# EAGLE design main (EAGLE 9.6.2)
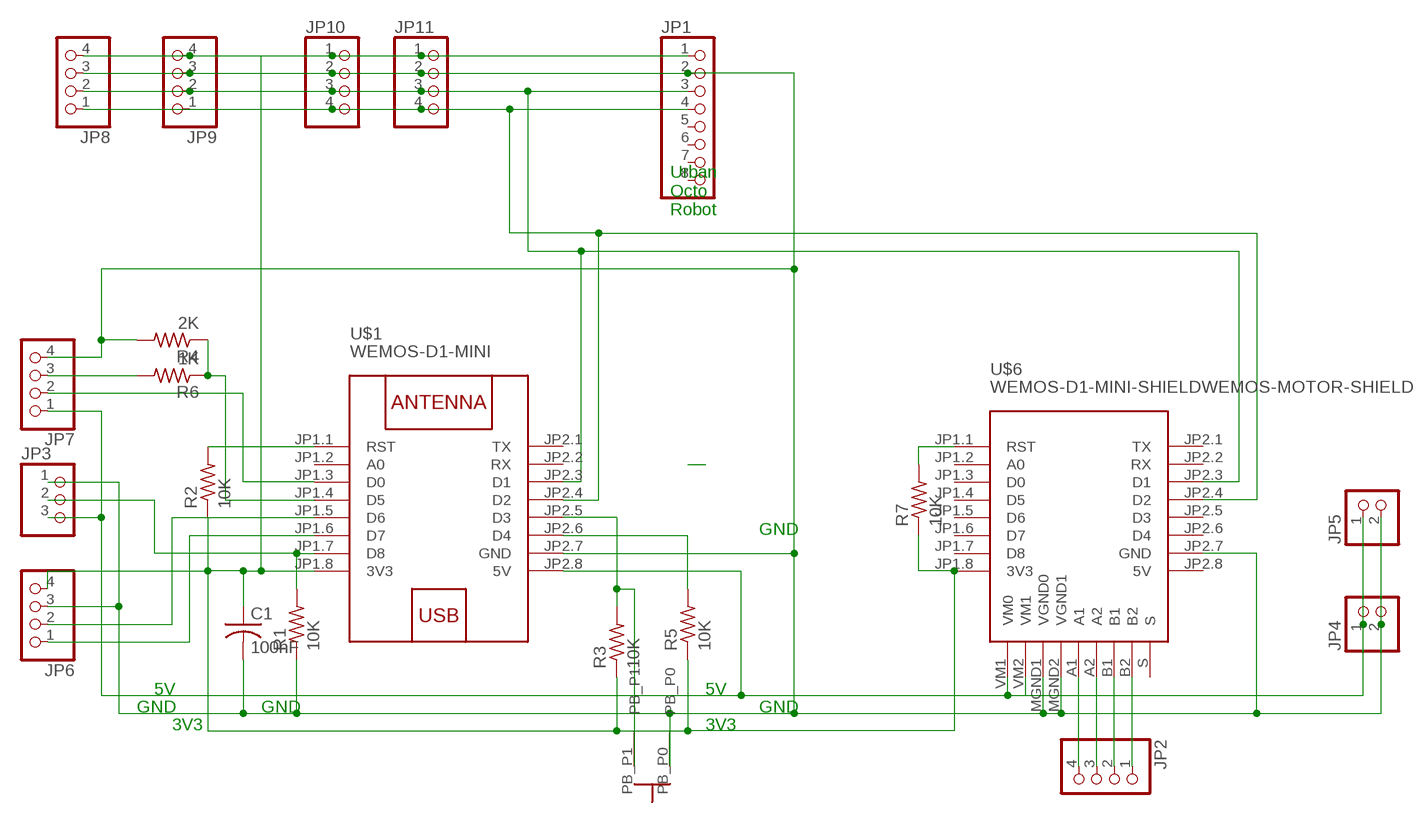
[diagram p0: schematic, sheet 1]

## Parts
C1  100nF  C-US050-024X044  [C050-024X044]
JP1  PINHD-1X8  [1X08]
JP2  PINHD-1X4/90  [1X04/90]
JP3  PINHD-1X3  [1X03]
JP4  PINHD-1X2  [1X02]
JP5  PINHD-1X2  [1X02]
JP6  PINHD-1X4  [1X04]
JP7  PINHD-1X4  [1X04]
JP8  PINHD-1X4  [1X04]
JP9  PINHD-1X4  [1X04]
JP10  PINHD-1X4  [1X04]
JP11  PINHD-1X4  [1X04]
R1  10K  R-US_0204/7  [0204/7]
R2  10K  R-US_0204/7  [0204/7]
R3  10K  R-US_0204/7  [0204/7]
R4  2K  R-US_0309/V  [0309V]
R5  10K  R-US_0204/7  [0204/7]
R6  1K  R-US_0309/V  [0309V]
R7  10K  R-US_0204/7  [0204/7]
U$1  WEMOS-D1-MINI  [WEMOS-D1-MINI]
U$6  WEMOS-D1-MINI-SHIELDWEMOS-MOTOR-SHIELD  [WEMOS-D1-MINI-SHIELD]
U$7  BUTTON6X6X10MMSIDE  [BUTTON6X6X10MMSIDE]

## Nets
N$1: JP2.4 U$6.A1
N$5: R7.2 U$6.JP1.1(RST)
N$6: JP3.3 JP4.1 JP5.1 JP7.1 U$1.JP2.8(5V) U$6.VM1(VM0) U$6.VM2(VM1)
N$9: JP7.3 R6.2
N$10: JP2.3 U$6.A2
N$11: JP6.2 U$1.JP1.5(D6)
N$12: R5.2 U$1.JP2.6(D4)
N$13: R4.1 R6.1 U$1.JP1.4(D5)
N$14: R2.2 U$1.JP1.1(RST)
N$15: JP3.2 R1.2 U$1.JP1.7(D8)
N$16: JP2.2 U$6.B1
N$17: JP2.1 U$6.B2
N$18: R3.2 U$1.JP2.5(D3) U$7.PB_P1
N$19: JP7.2 U$1.JP1.3(D0)
N$20: JP6.1 U$1.JP1.6(D7)
N$21: C1.1 JP1.1 JP6.4 JP8.4 JP9.4 JP10.1 JP11.1 R2.1 R3.1 R5.1 R7.1 U$1.JP1.8(3V3) U$6.JP1.8(3V3)
N$22: C1.2 JP1.2 JP3.1 JP4.2 JP5.2 JP6.3 JP7.4 JP8.3 JP9.3 JP10.2 JP11.2 R1.1 R4.2 U$1.JP2.7(GND) U$6.JP2.7(GND) U$6.MGND1(VGND0) U$6.MGND2(VGND1) U$7.PB_P0
N$23: JP1.3 JP8.2 JP9.2 JP10.3 JP11.3 U$1.JP2.3(D1) U$6.JP2.3(D1)
N$24: JP1.4 JP8.1 JP9.1 JP10.4 JP11.4 U$1.JP2.4(D2) U$6.JP2.4(D2)
Unconnected: JP1.5 JP1.6 JP1.7 JP1.8 U$1.JP1.2(A0) U$1.JP2.1(TX) U$1.JP2.2(RX) U$6.JP1.2(A0) U$6.JP1.3(D0) U$6.JP1.4(D5) U$6.JP1.5(D6) U$6.JP1.6(D7) U$6.JP1.7(D8) U$6.JP2.1(TX) U$6.JP2.2(RX) U$6.JP2.5(D3) U$6.JP2.6(D4) U$6.S

## Notes on the sheet
- Urban
  Octo
  Robot
- GND
- 5V | 5V
- GND | GND | GND
- 3V3 | 3V3

## Power pins joined to a net without a drawn wire
5V: U$6.JP2.8(5V)

## Library data of the parts
C1 = resistor:C-US: CAPACITOR, American symbol
JP1 = pinhead:PINHD-1X8: PIN HEADER
JP2 JP6-JP11 = pinhead:PINHD-1X4: PIN HEADER
JP3 = pinhead:PINHD-1X3: PIN HEADER
JP4 JP5 = pinhead:PINHD-1X2: PIN HEADER
R1-R7 = resistor:R-US_: RESISTOR, American symbol
U$1 = diy-modules:WEMOS-D1-MINI: WEMOS D1 mini: Mini Wi-Fi Board based on ESP-8266 device More details can be found here: https://www.wemos.cc/product/d1-mini.html Click here to find device on ebay.com <http://www.ebay.com/sch/wemos+d1+mini+nodemcu>
U$6 = glowmouse_custom:WEMOS-D1-MINI-SHIELD: Template for WEMOS D1 mini compatible shields NOTICE: This is a template only. You can use it as a base to create symbols for WEMOS D1 mini compatible shields. Official list of available shields can be found here: https://www.wemos.cc/D1-mini-Shields
U$7 = glowmouse_custom:BUTTON6X6X10MMSIDE

## Board
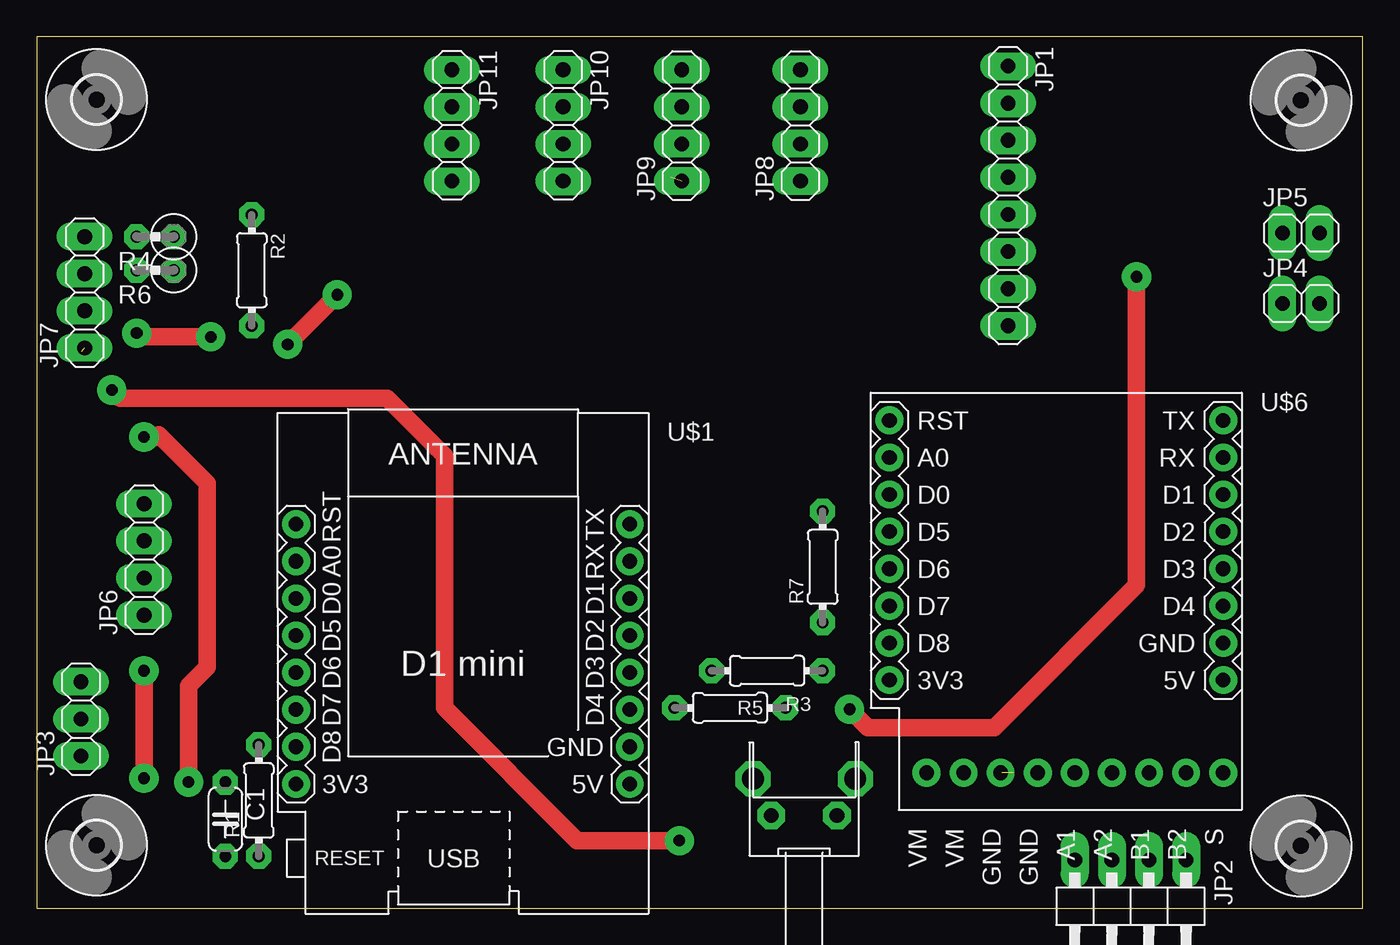
[diagram p1: board, top side]
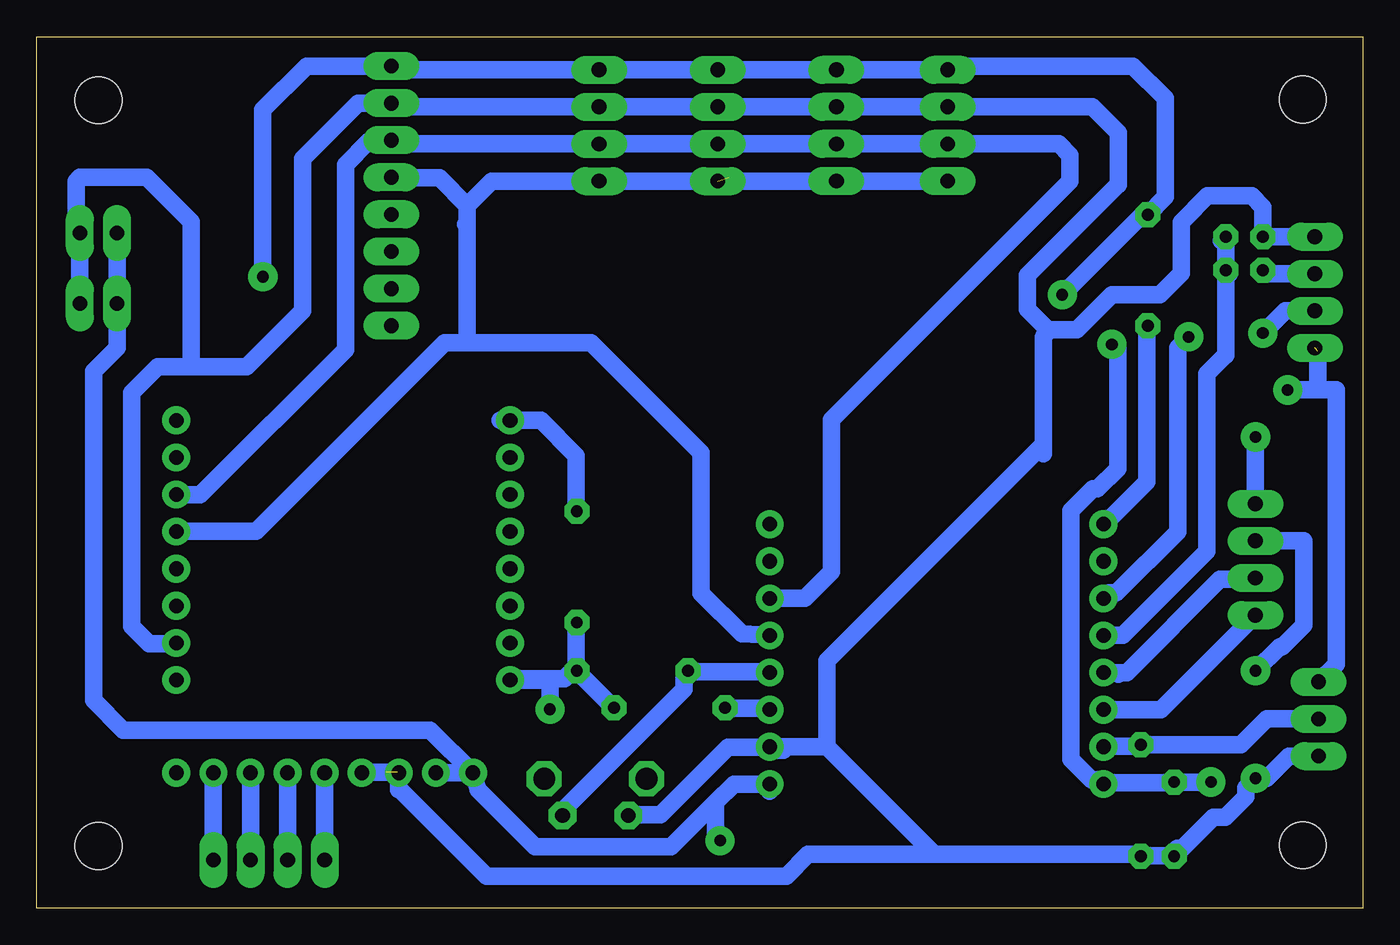
[diagram p2: board, bottom side, seen from below]

Size 90.86 x 59.68 mm. Coordinates in mm from the lower left corner, seen from the top.
Outline: 0,0 90.86,0 90.86,59.68 0,59.68 0,0
Copper layers (1*16): Top 0.035mm / dielectric 1.5mm / Bottom 0.035mm
Design rules "diy_board_drcs *": minimum track width 1.2mm, minimum drill 0.8mm, track to track 0.8mm, track to pad 0.6mm, pad to pad 0.8mm, via to via 1mm, smd to smd 8mil, copper to edge 40mil, drill to drill 8mil, minimum pad ring 0.4mm, minimum via ring 0.6mm, stop-mask expansion 4mil, vias tented up to drill 0mil, thermal gap 10mil

### Footprints (pad centres in the part's own frame; a part is rotated, then mirrored left to right if it is on the bottom)
C050-024X044 = drill 0.813 octagon: 1 -2.54,0; 2 2.54,0
1X08 = drill 1.016 long: 1 -8.89,0; 2 -6.35,0; 3 -3.81,0; 4 -1.27,0; 5 1.27,0; 6 3.81,0; 7 6.35,0; 8 8.89,0
1X04/90 = drill 1.016 long: 1 -3.81,-3.81; 2 -1.27,-3.81; 3 1.27,-3.81; 4 3.81,-3.81
1X03 = drill 1.016 long: 1 -2.54,0; 2 0,0; 3 2.54,0
1X02 = drill 1.016 long: 1 -1.27,0; 2 1.27,0
1X04 = drill 1.016 long: 1 -3.81,0; 2 -1.27,0; 3 1.27,0; 4 3.81,0
0204/7 = drill 0.813 octagon: 1 -3.81,0; 2 3.81,0
0309V = drill 0.813 octagon: 1 -1.27,0; 2 1.27,0
WEMOS-D1-MINI = drill 1: JP1.1 -11.43,9.525; JP1.2 -11.43,6.985; JP1.3 -11.43,4.445; JP1.4 -11.43,1.905; JP1.5 -11.43,-0.635; JP1.6 -11.43,-3.175; JP1.7 -11.43,-5.715; JP1.8 -11.43,-8.255; JP2.1 11.43,9.525; JP2.2 11.43,6.985; JP2.3 11.43,4.445; JP2.4 11.43,1.905; JP2.5 11.43,-0.635; JP2.6 11.43,-3.175; JP2.7 11.43,-5.715; JP2.8 11.43,-8.255
3,2 = hole 3.2: 0,0
WEMOS-D1-MINI-SHIELD = drill 1: A1 1.27,-12.065; A2 3.81,-12.065; B1 6.35,-12.065; B2 8.89,-12.065; JP1.1 -11.43,12.065; JP1.2 -11.43,9.525; JP1.3 -11.43,6.985; JP1.4 -11.43,4.445; JP1.5 -11.43,1.905; JP1.6 -11.43,-0.635; JP1.7 -11.43,-3.175; JP1.8 -11.43,-5.715; JP2.1 11.43,12.065; JP2.2 11.43,9.525; JP2.3 11.43,6.985; JP2.4 11.43,4.445; JP2.5 11.43,1.905; JP2.6 11.43,-0.635; JP2.7 11.43,-3.175; JP2.8 11.43,-5.715; MGND1 -3.81,-12.065; MGND2 -1.27,-12.065; S 11.43,-12.065; VM1 -8.89,-12.065; VM2 -6.35,-12.065
BUTTON6X6X10MMSIDE = drill 1.5 octagon: P$3 3.5,2.5; P$4 -3.5,2.5 | drill 1 octagon: PB_P0 -2.25,0; PB_P1 2.25,0

### Placement (x,y rotation side)
C1  12.94,6.1 270 top
JP1  66.55,48.77 270 top
JP2  74.93,-0.51 180 top
JP3  3.05,12.95 90 top
JP4  86.61,41.4 0 top
JP5  86.61,46.23 0 top
JP6  7.37,23.88 90 top
JP7  3.3,42.16 90 top
JP8  52.32,53.59 90 top
JP9  44.2,53.59 90 top
JP10  36.07,53.59 270 top
JP11  28.45,53.59 270 top
R1  15.22,7.37 90 top
R2  14.75,43.68 270 top
R3  50.04,16.26 180 top
R4  8.13,45.97 180 top
R5  47.5,13.72 180 top
R6  8.13,43.69 180 top
R7  53.85,23.37 90 top
U$1  29.21,16.76 0 top
U$2  [3,2]  4.12,4.31 0 top
U$3  [3,2]  86.61,55.32 270 top
U$4  [3,2]  4.12,55.36 0 top
U$5  [3,2]  86.61,4.26 270 top
U$6  69.85,21.34 0 top
U$7  52.58,6.35 0 top

### Tracks (layer width: path | path; a pad name or v marks a point on that pad's centre or on a via)
N$1
  Bottom 1.2: U$6.A1 JP2.4
N$5
  Bottom 1.2: R7.2 53.9,27.2 53.9,30.99 56.31,33.4 59.1,33.4 59.09,33.41 U$6.JP1.1
N$6  (via drill 0.8)  (1 unrouted)
  Top 1.2: v5.16,35.48 5.73,34.91 24.02,34.91 27.94,30.99 27.94,13.72 37.03,4.62 v44.03,4.62
  Bottom 1.2: 3.1,38.14 3.1,35.48 | JP3.3 1.83,16.71 1.83,35.48 3.1,35.48 | 44.34,7.26 47.4,4.2 56.7,4.2 60.6,8.1 U$6.VM1 | 44.34,7.26 43.1,8.5 40.7,8.5 U$1.JP2.8 40.64,8.02 | U$6.VM2 63.44,9.3 63.41,9.27 U$6.VM1 | 61.54,9.3 U$6.VM1 | v5.16,35.48 3.1,35.48 | 44.34,7.26 44.34,4.93 v44.03,4.62 | U$6.VM1 63.88,12.19 84.92,12.19 86.95,14.22 86.95,36.74 85.34,38.35 JP4.1 JP5.1
N$9
  Bottom 1.2: R6.2 6.76,43.4 6.72,43.43 JP7.3
N$10
  Bottom 1.2: U$6.A2 JP2.3
N$11
  Bottom 1.2: 16.76,16 16.89,16.13 U$1.JP1.5 16.18,16.13 9.8,22.5 8.03,22.5 7.87,22.35 7.62,22.35 JP6.2
N$12
  Bottom 1.2: R5.2 43.6,13.7 40.8,13.7 40.7,13.6 U$1.JP2.6
N$13
  Bottom 1.2: R6.1 9.45,43.75 9.4,43.8 R4.1 9.7,45.7 | R6.1 9.14,43.43 | U$1.JP1.4 17.7,18.7 16.44,18.7 10.7,24.44 10.7,36.58 9.43,37.85 9.4,37.85 R6.1
N$14
  Bottom 1.2: R2.2 14.8,39.8 14.8,29.2 17.7,26.3 U$1.JP1.1
N$15
  Bottom 1.2: U$1.JP1.7 17.7,11.1 15.31,11.1 R1.2 8.37,11.18 6.6,12.95 JP3.2
N$16
  Bottom 1.2: U$6.B1 JP2.2
N$17
  Bottom 1.2: 78.84,9.17 U$6.B2 JP2.1
N$18
  Bottom 1.2: U$1.JP2.5 40.7,16.2 46.2,16.2 R3.2 46.5,15.7 46.5,15 54.8,6.7 54.8,6.4 U$7.PB_P1
N$19  (via drill 0.8)
  Top 1.2: v11.94,39.12 7.11,39.12 v6.86,39.37
  Bottom 1.2: U$1.JP1.3 17.39,21.6 16.89,21.6 12.7,25.79 12.7,38.35 v11.94,39.12 | v6.86,39.37 5.33,40.89 JP7.2
N$20
  Bottom 1.2: JP6.1 13.84,13.59 U$1.JP1.6
N$21  (via drill 0.8)
  Top 1.2: v20.6,42 v17.2,38.6 | v55.69,13.61 56.96,12.34 65.6,12.34 75.35,22.09 v75.35,43.23 | v10.41,8.64 10.41,15.24 11.68,16.51 11.68,29.1 8.53,32.26 | 8.53,32.26 8.38,32.4 | v7.37,32.26 8.53,32.26
  Bottom 1.2: R5.1 51.4,13.8 53.8,16.2 R3.1 | R7.1 53.9,19.5 53.9,16.8 R3.1 | R3.1 54.4,16 54.7,15.7 58.34,15.7 U$6.JP1.8 55.69,15.62 v55.69,13.61 | 66.5,57.7 JP1.1 | v17.2,38.6 16.95,38.6 16.8,38.45 16.8,30.1 18.2,28.7 18.5,28.7 20,27.2 20,10.2 18.6,8.8 18.3,8.8 U$1.JP1.8 17.7,8.6 13.02,8.6 C1.1 v10.41,8.64 | v20.6,42 15.3,47.3 R2.1 13.53,48.7 13.53,55.44 15.75,57.66 28.19,57.66 JP11.1 JP10.1 JP9.4 JP8.4 66.29,57.4 JP1.1 | v75.35,43.23 75.35,43.24 75.35,54.66 72.36,57.66 JP1.1 | JP6.4 v7.37,32.26
N$22  (via drill 0.8)  (1 unrouted)
  Top 1.2: v7.37,8.89 v7.37,16.26 7.37,16.51
  Bottom 1.2: 66.5,55.1 JP1.2 | 21.6,39.6 19.6,39.6 17.2,42 13.9,42 12.45,43.45 12.45,46.96 11.53,47.87 11.53,47.91 10.67,48.77 7.62,48.77 6.86,48.01 R4.2 JP7.4 | 21.6,39.6 23,41 23,43.32 16.79,49.53 16.76,49.53 16.76,53.09 18.54,54.86 JP11.2 JP10.2 JP9.3 | 66.9,9.3 68.54,9.3 U$6.MGND2 | 66.14,9.3 U$6.MGND1 66.04,8.09 65.88,8.03 60.05,2.2 39.5,2.2 38,3.7 29.46,3.7 | U$6.JP2.7 81.24,18.1 83.12,18.1 84.33,19.3 84.33,35.31 82.55,37.08 80.26,37.08 | U$7.PB_P0 50.3,6.4 48.1,6.4 43.5,11 40.7,11 U$1.JP2.7 | C1.2 13.02,3.6 15.21,3.6 R1.1 15.81,3.7 29.46,3.7 | 12.72,4.1 C1.2 | 39.7,10.8 40.1,10.8 U$1.JP2.7 | 21.9,31.1 21.9,31.75 | 21.9,31.75 21.9,39.1 21.6,39.6 | JP9.3 44.58,54.48 | JP1.2 66.29,54.86 JP8.3 JP9.3 | JP1.2 68.83,55.12 72.64,51.31 72.64,40.89 76.45,37.08 80.26,37.08 | 80.26,37.08 80.26,46.99 83.31,50.04 87.88,50.04 88.14,49.78 88.14,46.48 JP5.2 JP4.2 | C1.2 10.26,6.24 9.42,6.24 8.01,7.64 8.01,8.24 v7.37,8.89 6.6,8.89 5.08,10.41 JP3.1 | v7.37,16.26 5.71,17.91 5.51,17.91 4.06,19.36 4.06,25.15 JP6.3 | U$1.JP2.7 36.7,11.05 | 29.46,3.7 29.46,3.81 36.7,11.05 | 21.9,31.75 36.7,16.95 36.7,11.05
N$23
  Bottom 1.2: JP1.3 66.6,52.5 68.1,52.5 69.7,50.9 69.7,38.25 79.63,28.32 U$6.JP2.3 | 40.6,21.3 U$1.JP2.3 38.23,21.21 36.4,23.04 36.4,33.45 20.07,49.78 20.07,51.56 20.83,52.32 JP11.3 JP10.3 JP9.2 JP8.2 66.29,52.32 JP1.3 | 66,52.4 JP1.3
N$24  (1 unrouted)
  Bottom 1.2: U$6.JP2.4 81.24,25.8 75.8,25.8 62.9,38.7 61.47,38.7 | JP1.4 66.5,50 63.26,50 61.37,48.11 | 40.6,18.7 U$1.JP2.4 42.54,18.77 45.34,21.57 45.34,31.17 52.87,38.7 61.47,38.7 | 43.43,50.04 43.18,49.78 | 61.47,46.84 61.37,46.74 | 61.47,38.7 61.37,38.8 61.37,46.74 | 61.37,46.74 61.37,48.11 | 61.37,48.11 59.69,49.78 JP8.1 JP9.1 JP10.4 JP11.4